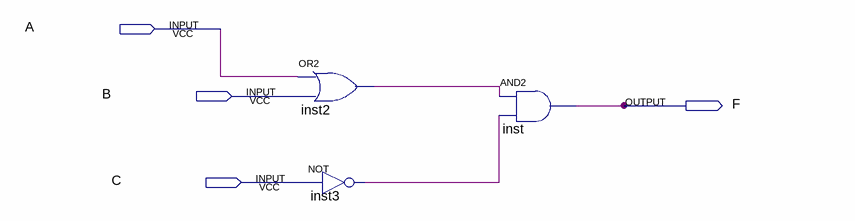
[diagram p0: schematic sheet]
// Quartus schematic lab2step1.bdf as structural Verilog: 3 symbols, 4 pins
module lab2step1 (
  input  A,
  input  B,
  input  C,
  output F
);

  wire inst2_out, inst3_out;

  or inst2 (inst2_out, A, B);
  not inst3 (inst3_out, C);
  and inst (F, inst2_out, inst3_out);
endmodule
